# EAGLE design Adafruit Ultimate GPS (EAGLE 6.6.0)
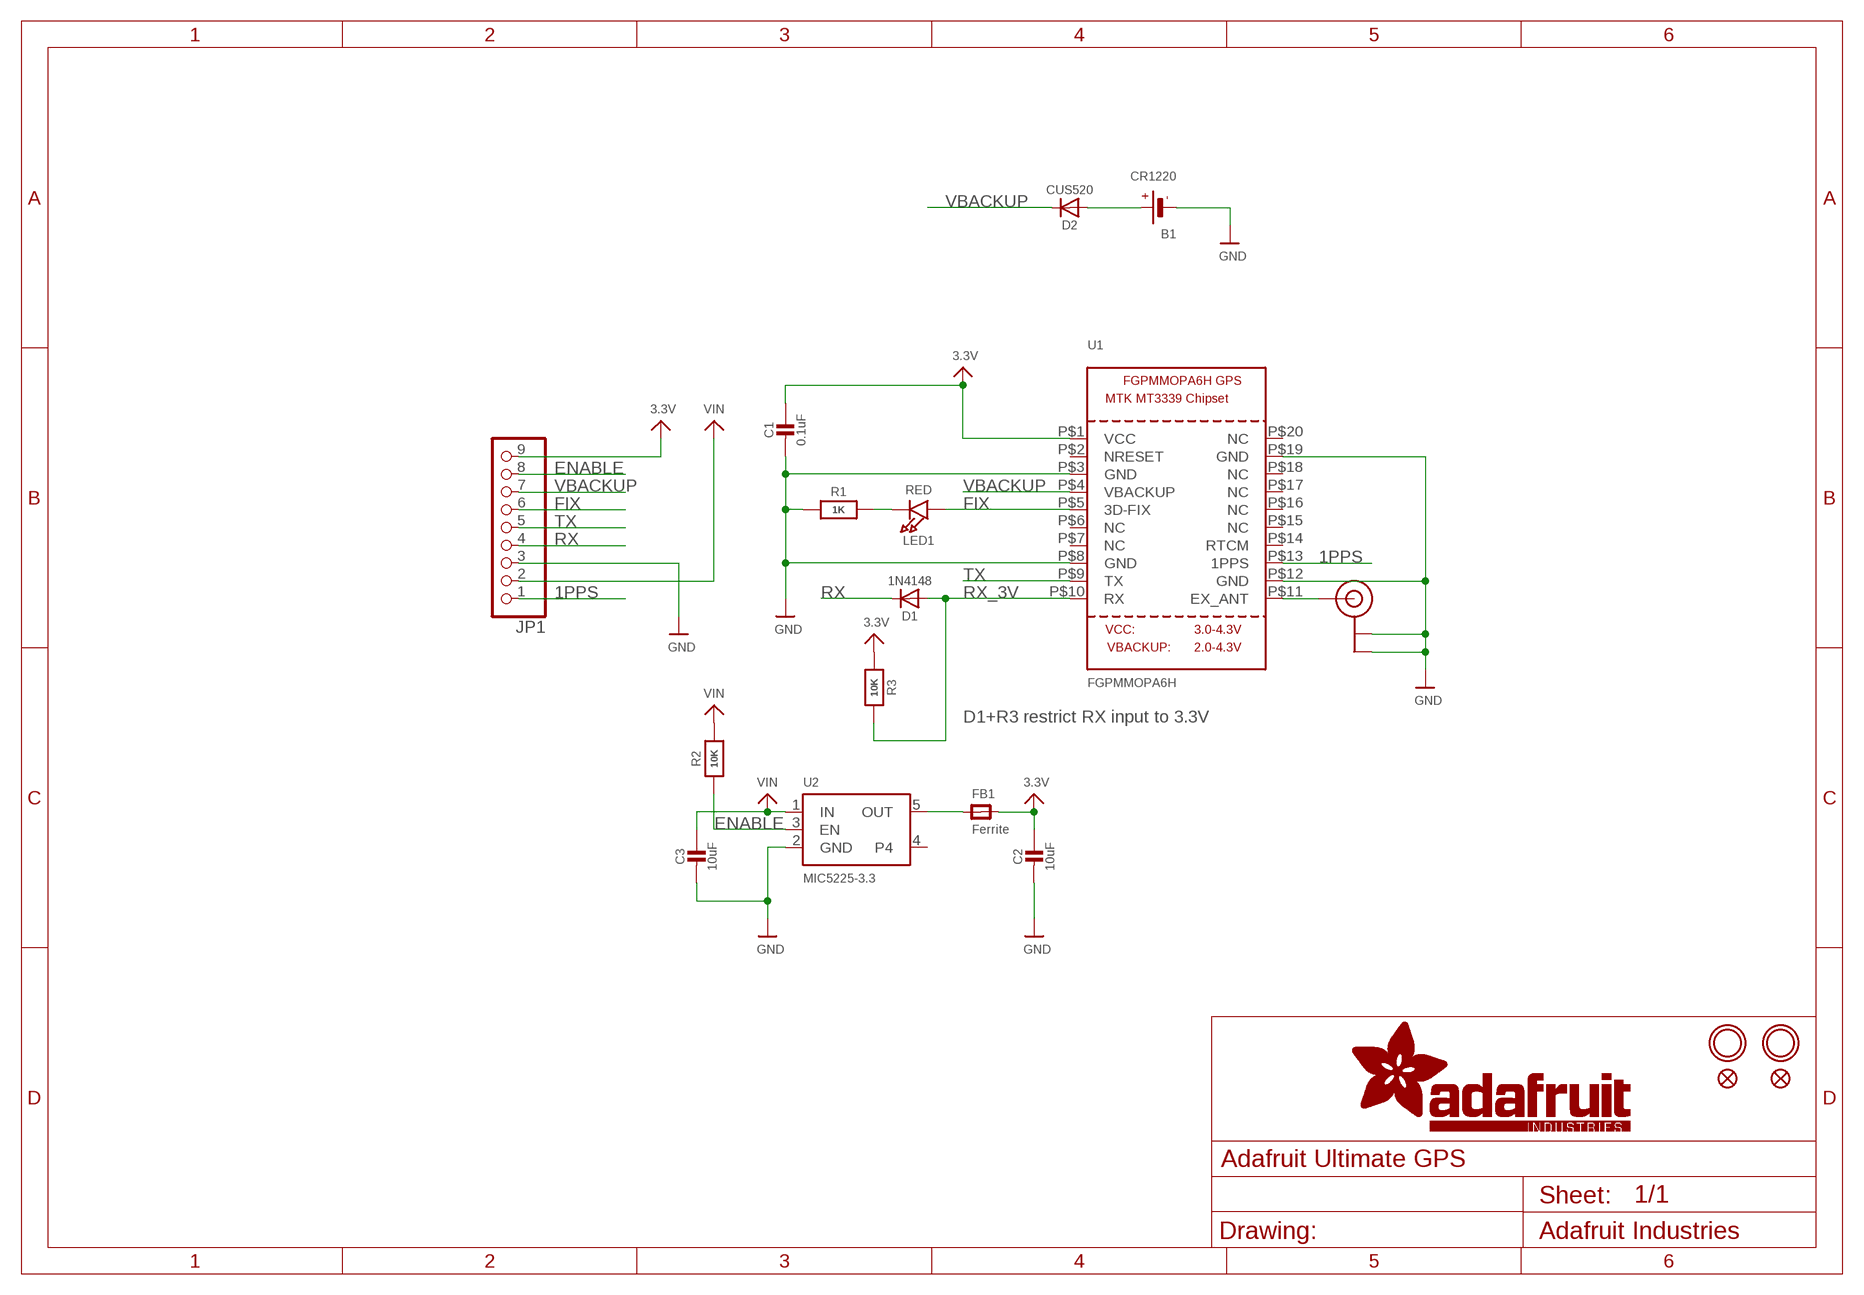
[diagram p0: schematic, sheet 1]

## Parts
B1  CR1220  BATTERYCR1220_SMT  [CR1220]
C1  0.1uF  CAP_CERAMIC0805-NOOUTLINE  [0805-NO]
C2  10uF  CAP_CERAMIC0805-NOOUTLINE  [0805-NO]
C3  10uF  CAP_CERAMIC0805-NOOUTLINE  [0805-NO]
D1  1N4148  DIODESOD-323  [SOD-323]
D2  CUS520  DIODESOD-323  [SOD-323]
FB1  Ferrite  FERRITE-0805NO  [0805-NO]
FID1  FIDUCIAL""  [FIDUCIAL_1MM]
FID2  FIDUCIAL""  [FIDUCIAL_1MM]
JP1  HEADER-1X970MIL  [1X09_ROUND_70]
LED1  RED  LED0805  [CHIPLED_0805]
R1  1K  RESISTOR0805_NOOUTLINE  [0805-NO]
R2  10K  RESISTOR0805_NOOUTLINE  [0805-NO]
R3  10K  RESISTOR0805_NOOUTLINE  [0805-NO]
U1  FGPMMOPA6H  GPS_FGPMMOPA6H  [FGPMMOPA6H]
U2  MIC5225-3.3  VREG_SOT23-5  [SOT23-5]
U$8  MOUNTINGHOLE2.5  [MOUNTINGHOLE_2.5_PLATED]
U$9  MOUNTINGHOLE2.5  [MOUNTINGHOLE_2.5_PLATED]
U$20  U.FL  [U.FL]

## Nets
1PPS: JP1.1 U1.P$13(1PPS)
3.3V: C1.1 C2.1 FB1.2 JP1.9 R3.1 U1.P$1(VCC)
ENABLE: JP1.8 R2.1 U2.3(EN)
FIX: JP1.6 LED1.A U1.P$5(3D-FIX)
GND: B1.- C1.2 C2.2 C3.2 JP1.3 R1.1 U1.P$3(GND) U1.P$8(GND) U1.P$12(GND) U1.P$19(GND) U2.2(GND) U$20.P$1(GND) U$20.P$2(GND)
N$1: B1.+$1(+) B1.+$2(+) D2.A
N$2: LED1.C R1.2
N$3: FB1.1 U2.5(OUT)
N$4: U1.P$11(EX_ANT) U$20.P$3(SIGNAL)
RX: D1.C JP1.4
RX_3V: D1.A R3.2 U1.P$10(RX)
TX: JP1.5 U1.P$9(TX)
VBACKUP: D2.C JP1.7 U1.P$4(VBACKUP)
VIN: C3.1 JP1.2 R2.2 U2.1(IN)
Unconnected: U1.P$2(NRESET) U1.P$6(NC) U1.P$7(NC) U1.P$14(RTCM) U1.P$15(NC) U1.P$16(NC) U1.P$17(NC) U1.P$18(NC) U1.P$20(NC) U2.4

## Notes on the sheet
- D1+R3 restrict RX input to 3.3V

## Library data of the parts
B1 = microbuilder:BATTERY: CR1220 SMT - Digikey: 3001K-ND CD2032 BAT-HLD-001 - Digikey: BAT-HLD-001-ND
C1-C3 = microbuilder:CAP_CERAMIC: Ceramic Capacitors For new designs, use the packages preceded by an '_' character since they are more reliable: The following footprints should be used on most boards: _0402 - Standard footprint for regular board layouts _0603 - Standard footprint for regular board layouts _0805 - Standard footprint for regular board layouts _1206 - Standard footprint for regular board layouts For extremely tight-pitch boards where space is at a premium, the following 'micro-pitch' footprints can be used (smaller pads, no silkscreen outline, etc.): _0402MP - Micro-pitch footprint for very dense/compact boards _0603MP - Micro-pitch footprint for very dense/compact boards _0805MP - Micro-pitch footprint for very dense/compact boards _1206MP - Micro-pitch footprint for very dense/compact boards
D1 D2 = microbuilder:DIODE: Diode SMA Model Volts Amps Type Vf Ir Digikey # Notes SSA34-E3 40V 3A Schottky 480mV @ 3A 200uA @ 40V SSA34-E3/61TGITR-ND CDBA120-G 20V 1A Schottky 500mV @ 1A 500uA @ 20V 641-1014-6-ND REEL MBRA210 10V 2A Schottky 350mV @ 2A 700uA @ 10V MBRA210LT3 SOD-123 Model Volts Amps Type Vf Ir Order # Notes BAT54T1G 30V 200mA Schottky 800mV @ 200mA 2uA @ 25V BAT54T1GOSTR-ND B0530W 30V 500mA Schottky 430mV @ 500mA 130uA @ 30V B0530W-FDICT-ND REEL MBR120 20V 1A Schottky 340mV @ 1A MBR120VLSFT1GOSCT-ND SOD-323 Model Volts Amps Type Vf Ir Order # Notes PMEG2005EJ 20V 500mA Schottky 355mV @ 500mA 568-4110-1-ND ZLLS410 10V 570mA Schottky 380mV @ 570mA ZLLS410CT-ND 1N4148WS 75V 150mA Silicon/Simple 1V 1N4148WSFSCT-ND REEL SOD-523 Model Volts Amps Type Vf Ir Order # Notes BAT54XV2 30V 200mA Schottky 0.8V @ 100mA BAT54XV2CT-ND TB751S 30V 30mA Schottky RB751S-40TE61CT-ND SOT23-R/W (R = Solder Paste/Reflow Ovens, W = Hand-Soldering) Model Volts Amps Type Vf Ir Order # Notes BAT54FILM 40V 300mA Schottky 497-7162-1-ND POWERDI-5 Model Volts Amps Type Vf Ir Order # Notes PDS560 60V 5A Schottky 670mV @ 5A 150uA @ 60V PDS560DICT-ND
FB1 = microbuilder:FERRITE: Ferrite Bead 0603 MMZ1608B121C - 120 Ohm @ 100MHz, 600mA, 0.15 Ohm DC Resistance - Digikey: 445-2164-1-ND BK1608HW121-T - 120 Ohm, 600mA Ferrite Chip - Digikey: 587-1876-2-ND 0805 HZ0805B272R-10 - 2.7K Ohm @ 100MHz, 200mA, 0.8 Ohm DC Resistance - Digikey: 240-2504-1-ND (see also Murata BLM21BD272SN1L) MMZ2012Y152B - 1.5K Ohm @ 100MHz, 500mA, 0.4 Ohm DC Resistance - Digikey: 445-1560-1-ND - Mainly for high frequency (80-400MHz) MMZ2012R102A - 1K Ohm @ 100MHz, 500mA, 0.3 Ohm DC Resistance - Digikey: 445-1555-2-ND - More general purpose (10-200MHz)
FID1 FID2 = microbuilder:FIDUCIAL: Fiducial Alignment Points Various fiducial points for machine vision alignment.; BOM: EXCLUDE
JP1 = microbuilder:HEADER-1X9: PIN HEADER
LED1 = microbuilder:LED: LED 0603 - 0603 Surface Mount Package 2mA: Green LED - Low Power (3.9mcd, 2ma, 1.7Vf) - Digikey: 475-2709-2-ND Orange LED - Low Power (9.8mcd, 2ma, 1.8Vf) - Digikey: 475-1194-2-ND Red LED - Low Power (5mcd, 2ma, 1.8Vf) - Digikey: 475-1195-2-ND Yellow LED - Low Power (7mcd, 2ma, 1.8Vf) - Digikey: 475-1196-2-ND 5mA: Blue LED - Low Power (17mcd, 5ma, 2.9Vf) - Digikey: LNJ937W8CRACT-ND 0805 - 0805 Surface Mount Package 2mA: Red LED (8.8mcd, 2mA, 1.8Vf, Clear) - Low Power [Digikey: 475-2510-1-ND] Green LED (5mcd, 2mA, 1.8Vf, Clear) - Low Power [Digikey: 475-2730-1-ND] Yellow LED (11.3mcd, 2mA, 1.8Vf, Clear) - Low Power [Digikey: 475-2555-1-ND] 20mA: Red LED (104mcd, 20mA, Diffused) - LS R976 [Digikey: 475-1278-6-ND] Red LED (12mcd, 20mA, 2.0Vf, Clear) - APT2012EC [Digikey: 754-1128-1-ND] Green LED (15mcd, 20mA, 2.2Vf, Clear) - APT2012GC [Digikey: 754-1131-1-ND] Orange LED (160mcd, 20mA, 2.1Vf, Clear) - APT2012SECK [Digikey: 754-1130-1-ND] 1206 - 1206 Surface Mount Package Green LED (26mcd, 20mA, Diffused) - LG N971 [Digikey: 475-1407-6-ND] Red LED (15mcd, 20mA, Diffused) - LH N974 [Digikey: 475-1416-6-ND] Cree - Cree High-Power Surface Mount LEDs XPEBWT-L1-0000-00D50 - White 111lm 350mA 2.9Vf 6200K 110° XTEAWT-00-0000-00000LEE3 - White 114lm 350mA 2.85Vf 5000K 115° Everlight - Everlight 45-21 Series Surface Mount LEDs 45-21/QK2C-B2832AC2CB2/2T - Warm White 2000mcd 20mA 3.25Vf 3050K 120° 45-21/LK2C-B38452C4CB2/2T - Nuetral White 2000mcd 20mA 3.25Vf 4150K 120° 45-21/LK2C-B50634C6CB2/2T - Cold White 2200mcd 20mA 3.25Vf 5650K 120° PLCC2 Reverse Mount LS T77K-J1L2-1-0-2-R18-Z - Red 11.25mcd 2mA 1.8Vf 630nm 120° LO T77K-L1M2-24-Z - Orange 19.6mcd 2mA 1.8Vf 606nm 120° LY T77K-K2M1-26-Z - Yellow 15.7mcd 2mA 1.8Vf 587nm 120°
R1-R3 = microbuilder:RESISTOR: Resistors For new designs, use the packages preceded by an '_' character since they are more reliable: The following footprints should be used on most boards: _0402 - Standard footprint for regular board layouts _0603 - Standard footprint for regular board layouts _0805 - Standard footprint for regular board layouts _1206 - Standard footprint for regular board layouts For extremely tight-pitch boards where space is at a premium, the following 'micro-pitch' footprints can be used (smaller pads, no silkscreen outline, etc.): _0402MP - Micro-pitch footprint for very dense/compact boards _0603MP - Micro-pitch footprint for very dense/compact boards _0805MP - Micro-pitch footprint for very dense/compact boards _1206MP - Micro-pitch footprint for very dense/compact boards
U1 = microbuilder:GPS_FGPMMOPA6H: GPS Module - MTK MT3339 Chipset, -165dBm sensitivity, 22 channels, 10Hz, auto-select external antenna options
U2 = microbuilder:VREG_SOT23-5: SOT23-5 Fixed Voltage Regulators Part Current Out V Out V In V Dropout θJA (°C/W) TJ (°C) Digikey Part No. ADP121 150mA 3.3V 3.4-5.5V 0.09V @ 150mA -- -- ADP121-AUJZ33R7CT-ND ADP121 150mA 3.0V 3.1-5.5V 0.09V @ 150mA -- -- ADP121-AUJZ30R7CT-ND ADP122 300mA 3.3V 3.4-5.5V 0.085V @ 300mA -- -- ADP122AUJZ-3.3-R7CT-ND ADP1712 300mA 3.3V 3.5-5.5V 0.17V @ 300mA -- -- ADP1712AUJZ-3.3-R7TR-ND AP7311 (Low Cost) 150mA 3.3V 3.5-6V 0.15V @ 150mA -- -- AP7311-33WG-7DICT-ND LD39015M18R 150mA 1.8V 1.9V-5.5V 0.08V @ 100mA -- -- 497-6977-1-ND LP2985A-33DBVR 150mA 3.3V 3.3-16V 0.28V @ 150mA 206 150 296-18479-1-ND MCP1824T-3302E/OT 300mA 3.3V 3.5V-6V 0.2V @ 300mA -- -- MCP1824T-3302E/OTCT-ND MIC5205-2.5YM5 TR 150mA 2.5V 2.7-16V 0.165V @ 150mA -- -- 576-1257-2-ND MIC5205-3.0YM5 TR 150mA 3.0V 3.2V-16V 0.165V @ 150mA -- -- 576-1258-2-ND MIC5205-3.3YM5 TR 150mA 3.3V 3.5V-16V 0.165V @ 150mA -- -- 576-1259-2-ND TPS780330220 150mA 3.3V+2.2V 3.6-5.5V 250mV Max -- -- 296-23332-1-ND TDA3663/N1,135 100mA 3.3V 3.5-45V 0.18V @ 50mA -- -- 568-5343-1-ND Max operating temp can be calculated using θJA, TJ (max junction temperature), and power in watts. Set the "Maximum Ambient Temperature" until it reaches TJ ("Max Junction Temperature"), which is the absolute limit for safe use of the regulator: Heat Sink Temperature Calculator <http://www.daycounter.com/Calculators/Heat-Sink-Temperature-Calculator.phtml> For example, With 12V source into a 3.3V LP2985 and a 30mA load, we are dissipating (12V-3.3V) * 0.03A = 0.261W. With a θJA of 206 °C/W, a TJ of 150°C, and 261mW we can safely use the chip without a heat sink up to 75°C (=147.1°C Junction Temperature).
U$8 U$9 = microbuilder:MOUNTINGHOLE: Mounting Hole For #2 screws (0.086"/2.18mm width, 0.094"/2.4mm hole) use 2.5mm; BOM: EXCLUDE
U$20 = microbuilder:U.FL: U.FL Antenna Connector

## Board
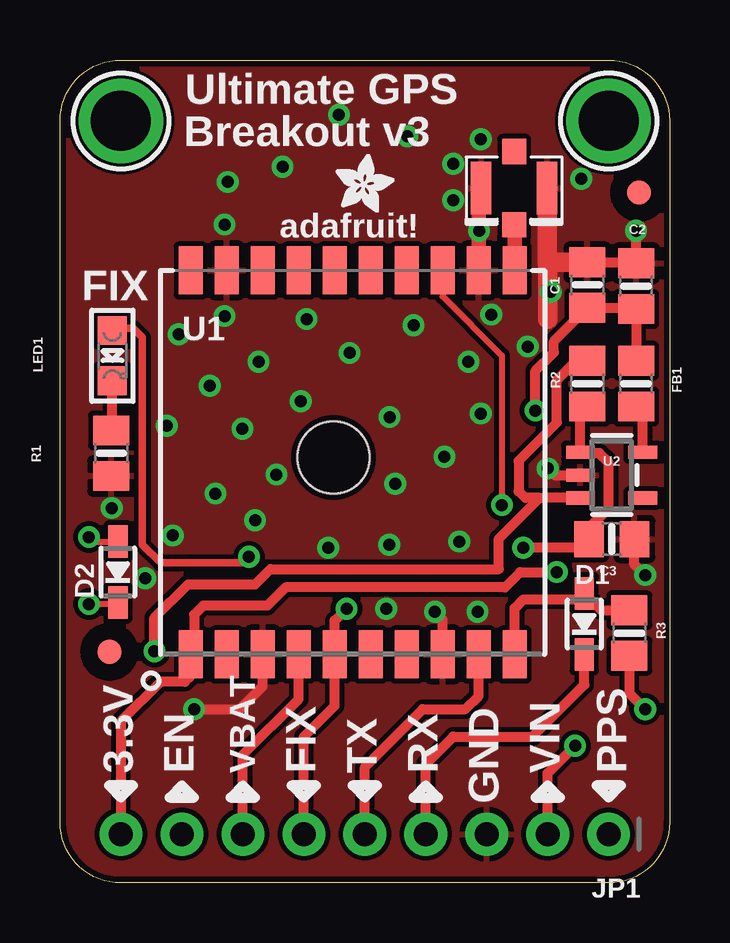
[diagram p1: board, top side]
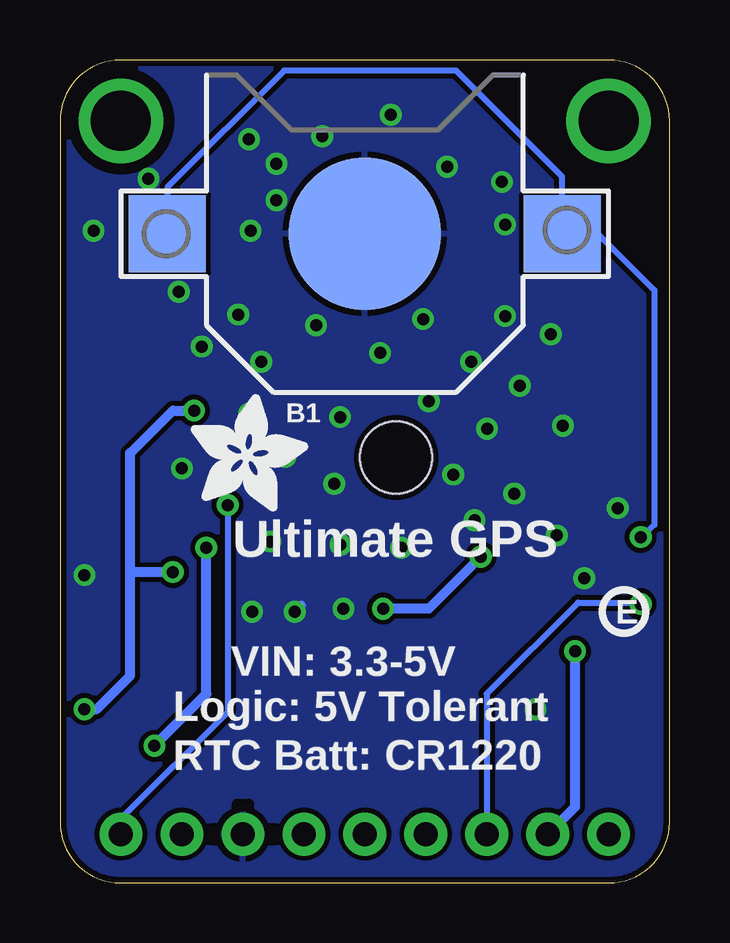
[diagram p2: board, bottom side, seen from below]

Size 25.4 x 34.29 mm. Coordinates in mm from the lower left corner, seen from the top.
Outline: 0,2.54 0,31.75 arc-90 2.54,34.29 22.86,34.29 arc-90 25.4,31.75 25.4,2.54 arc-90 22.86,0 2.54,0 arc-90 0,2.54
Copper layers (1*16): Top 0.035mm / dielectric 1.5mm / Bottom 0.035mm
Design rules "adafruit *": minimum track width 8mil, minimum drill 15.5mil, track to track 8mil, track to pad 8mil, pad to pad 8mil, via to via 8mil, smd to smd 8mil, copper to edge 10mil, drill to drill 8mil, minimum pad ring 10mil, minimum via ring 8mil, stop-mask expansion 2mil, vias tented up to drill 20mil, thermal gap 10mil
bRestrict: area 17.5,3.2 to 18,3.3; area 16.5,1.8 to 16.6,2.3; area 18.9,1.8 to 19.1,2.3

### Footprints (pad centres in the part's own frame; a part is rotated, then mirrored left to right if it is on the bottom)
CR1220 = smd 3.2 x 3.2: +$1 -8.225,0; +$2 8.225,0 | smd 6.35 x 6.35: - 0,0
0805-NO = smd 1.24 x 1.5: 1 -0.95,0; 2 0.95,0
SOD-323 = smd 1.35 x 0.8: A 1.27,0; C -1.27,0
FIDUCIAL_1MM = smd 1 x 1: 1 0,0
1X09_ROUND_70 = drill 1 pad 1.778: 1 -10.16,0; 2 -7.62,0; 3 -5.08,0; 4 -2.54,0; 5 0,0; 6 2.54,0; 7 5.08,0; 8 7.62,0; 9 10.16,0
CHIPLED_0805 = smd 1.2 x 1.2: A 0,-1.05; C 0,1.05
FGPMMOPA6H = smd 2 x 1: P$1 -8,6.75; P$2 -8,5.25; P$3 -8,3.75; P$4 -8,2.25; P$5 -8,0.75; P$6 -8,-0.75; P$7 -8,-2.25; P$8 -8,-3.75; P$9 -8,-5.25; P$10 -8,-6.75; P$11 8,-6.75; P$12 8,-5.25; P$13 8,-3.75; P$14 8,-2.25; P$15 8,-0.75; P$16 8,0.75; P$17 8,2.25; P$18 8,3.75; P$19 8,5.25; P$20 8,6.75 | hole 3: 0.2,0.8
SOT23-5 = smd 0.55 x 1.2: 1 -0.95,-1.3; 2 0,-1.3; 3 0.95,-1.3; 4 0.95,1.3; 5 -0.95,1.3
MOUNTINGHOLE_2.5_PLATED = drill 2.5 pad 3.2: P$1 0,0
U.FL = smd 2.2 x 0.85: P$1 0,1.375; P$2 0,-1.375 | smd 1.05 x 1: P$3 1.525,0; P$4 -1.525,0

### Placement (x,y rotation side)
B1  12.7,27.05 0 bottom
C1  21.97,24.92 90 top
C2  24,24.87 90 top
C3  22.99,14.33 0 top
D1  21.84,10.79 90 top
D2  2.41,12.95 90 top
FB1  24,20.8 90 top
FID1  24.13,28.77 0 top
FID2  2.06,9.63 0 top
JP1  12.7,2.03 180 top
LED1  2.18,21.97 180 top
R1  2.13,17.91 90 top
R2  21.97,20.8 270 top
R3  23.73,10.41 90 top
U1  12.19,17.53 90 top
U2  22.99,16.99 270 top
U$8  2.54,31.75 0 top
U$9  22.86,31.75 0 top
U$15  [ADAFRUIT_2.5MM]  11.49,27.94 0 top
U$16  [PCBFEAT-REV-040]  1.91,11.3 0 bottom
U$18  [ADAFRUIT_5MM]  19.94,15.49 0 bottom
U$20  18.92,28.96 270 top

### Tracks (layer width: path | path; a pad name or v marks a point on that pad's centre or on a via)
1PPS  (via drill 0.5)
  Top 0.254: U1.P$13 15.94,24.44 18.41,21.97 v18.41,15.75
  Bottom 0.254: v18.41,15.75 18.41,7.11 22.86,2.67 JP1.1
3.3V  (via drill 0.5)
  Top 0.406: FB1.2 C2.1 23.95,23.97 C1.1 20.57,22.57 20.57,22.1 19.81,21.34 v19.81,19.68 | JP1.9 2.54,6.73 4.19,8.38 5.21,8.38 5.44,8.62 U1.P$1 5.59,9.67 5.59,11.18 5.97,11.56 8.64,11.56 9.4,12.32 18.54,12.32 19.18,12.95 v20.7,12.95 | R3.1 23.73,7.9 v24.38,7.24
  Bottom 0.406: v24.38,7.24 23.88,7.24 22.48,8.64 22.48,12.95 | 22.48,12.95 22.48,17.91 20.7,19.68 v19.81,19.68 | v20.7,12.95 22.48,12.95
ENABLE  (via drill 0.5)
  Top 0.406: R2.1 21.93,21.72 21.46,21.72 20.7,20.95 20.7,19.18 19.11,17.59 19.11,16.32 19.39,16.04 19.98,16.04 | v3.94,9.65 3.94,11.05 5.33,12.45 8.13,12.45 8.76,13.08 18.29,13.08 18.29,14.35 19.98,16.04 | U2.3 20.19,16.04 19.98,16.04
  Bottom 0.406: v3.94,9.65 3.94,3.17 JP1.8
FIX  (via drill 0.5)
  Top 0.305: 2.28,23.11 3.05,23.11 3.43,22.73 3.43,14.1 4.19,13.34 7.62,13.34 v7.87,13.59
  Top 0.406: JP1.6 10.16,6.1 11.44,7.38 U1.P$5 11.44,10.93 v11.94,11.43 | 2.28,23.11 LED1.A
  Bottom 0.406: v7.87,13.59 10.03,11.43 v11.94,11.43
GND  (via drill 0.5)
  Top 0.406: v24,27.18 C2.2 23.95,25.87 C1.2 | U2.2 20.6,16.99 v20.32,17.27 | C3.2 23.94,13.27 v24.38,12.83 | U1.P$8 15.94,10.98 v15.62,11.3 | U1.P$3 8.44,8.19 7.49,7.24 v5.59,7.24 | 17.53,28.55 17.53,28.47 | U$20.P$2 17.53,28.96
  Top 0.61: U1.P$12 17.44,28.87 17.53,28.96 17.53,28.55
  Top 0.813: U$20.P$1 20.3,25.87 20.32,25.87 | 20.32,25.87 C1.2 | 20.32,23.5 20.32,25.87
  Bottom 0.406: v24,27.18 24,27.3 | v24.38,12.83 24.51,12.83 | v15.62,11.3 15.37,11.56 | v5.59,7.24 5.59,6.99
  other vias: 6.86,23.62 2.16,15.62 19.49,22.35 4.95,22.86 6.24,20.72 10.03,20.07 9.02,17.02 17.53,19.56 16.02,17.76 13.73,19.41 13.97,16.64 10.27,23.5 14.73,23.24 17.02,21.72 12.06,22.08 8.27,21.72 7.6,18.92 4.7,14.48 6.48,16.22 8.13,15.11 13.59,11.43 17.4,11.3 17.97,23.69 16.38,28.45 17.46,27.18 17.53,30.99 6.86,27.43 9.27,29.84 6.99,29.21 14.48,31.11 11.62,32 16.38,29.97 21.72,29.34 20.45,24.64 16.64,14.22 11.18,13.97 13.72,14.1 4.45,19.05 3.56,12.7
  pour Top (isolate 0.203): 0,0 0,33.92 25.4,33.92 25.4,0
  pour Bottom (isolate 0.203): 0,0 0,33.92 25.4,33.92 25.4,0
N$1  (via drill 0.5)
  Top 0.254: D2.A 1.33,14.22 1.21,14.35 v1.21,14.41
  Bottom 0.254: B1.+$1 20.93,28.99 16.07,33.85 8.89,33.85 4.47,29.43 B1.+$2 2.98,27.05 0.64,24.7 0.64,14.92 1.14,14.41 v1.21,14.41
N$2
  Top 0.406: LED1.C 2.18,18.91 R1.2
N$3
  Top 0.406: U2.5 24.29,19.57 FB1.1
N$4
  Top 0.406: 18.92,26.8 U$20.P$3 18.92,27.18 18.94,27.16
  Top 0.61: U1.P$11 18.94,27.16
RX
  Top 0.406: JP1.4 15.24,4.95 16.38,6.1 19.68,6.1 21.84,8.26 D1.C
RX_3V
  Top 0.406: U1.P$10 18.94,11.45 19.3,11.81 21.59,11.81 D1.A 22.55,11.36 R3.2
TX
  Top 0.406: JP1.5 12.7,4.83 15.11,7.24 16.89,7.24 17.44,7.79 U1.P$9
VBACKUP  (via drill 0.5)
  Top 0.254: D2.C 2.35,11.62 v1.21,11.62
  Top 0.406: JP1.7 7.62,5.33 9.94,7.66 U1.P$4
  Bottom 0.254: JP1.7 7.62,7.87 3.81,11.68 1.27,11.68 v1.21,11.62
VIN  (via drill 0.5)
  Top 0.406: R2.2 21.69,19.57 U2.1 21.72,17.91 22.48,17.91 22.86,17.53 22.86,15.62 22.04,14.8 C3.1 21.68,13.97 v19.3,13.97 | JP1.2 20.32,4.57 v21.46,5.71
  Bottom 0.406: v19.3,13.97 19.3,7.87 v21.46,5.71

### Text on the board
tPlace: Ultimate GPS | Breakout v3 | adafruit! | FIX | 3.3V | EN | VBAT | FIX | TX | RX | VIN | PPS | GND
bPlace: Ultimate GPS | VIN: 3.3-5V | Logic: 5V Tolerant | RTC Batt: CR1220